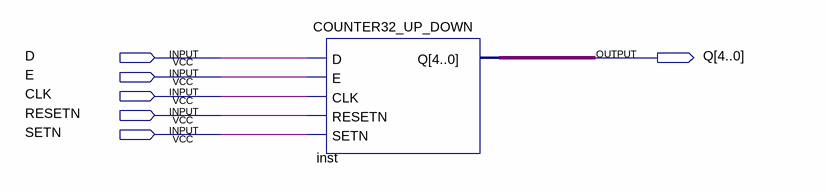
[diagram p0: schematic sheet]
// Quartus schematic COUNTER32.bdf as structural Verilog: 1 symbols, 6 pins
module COUNTER32 (
  input  D,
  input  E,
  input  CLK,
  input  RESETN,
  input  SETN,
  output [4:0] Q
);

  COUNTER32_UP_DOWN inst (.D(D), .E(E), .CLK(CLK), .RESETN(RESETN), .SETN(SETN), .Q(Q));
endmodule
